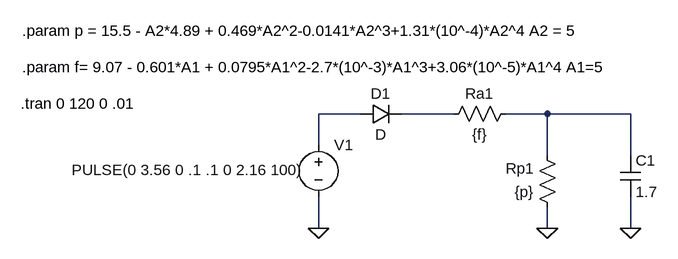
[diagram p0: schematic modelo_simulación.asc]
modelo_simulación.asc, the LTspice schematic file:
Version 4
SHEET 1 1532 680
WIRE 1056 32 992 32
WIRE 1200 32 1120 32
WIRE 1344 32 1280 32
WIRE 1472 32 1344 32
WIRE 992 80 992 32
WIRE 1344 96 1344 32
WIRE 1472 96 1472 32
WIRE 992 208 992 160
WIRE 1344 208 1344 176
WIRE 1472 208 1472 160
FLAG 1344 208 0
FLAG 1472 208 0
FLAG 992 208 0
SYMBOL res 1296 16 R90
WINDOW 0 0 56 VBottom 2
WINDOW 3 32 56 VTop 2
SYMATTR InstName Ra1
SYMATTR Value {f}
SYMBOL res 1360 192 R180
WINDOW 0 36 76 Left 2
WINDOW 3 36 40 Left 2
SYMATTR InstName Rp1
SYMATTR Value {p}
SYMBOL cap 1456 96 R0
SYMATTR InstName C1
SYMATTR Value 1.7
SYMBOL voltage 992 64 R0
WINDOW 3 -380 54 Left 2
WINDOW 123 0 0 Left 0
WINDOW 39 0 0 Left 0
SYMATTR InstName V1
SYMATTR Value PULSE(0 3.56 0 .1 .1 0 2.16 100)
SYMBOL diode 1056 48 R270
WINDOW 0 32 32 VTop 2
WINDOW 3 0 32 VBottom 2
SYMATTR InstName D1
TEXT 534 16 Left 2 !.tran 0 120 0 .01
TEXT 536 -40 Left 2 !.param f= 9.07 - 0.601*A1 + 0.0795*A1^2-2.7*(10^-3)*A1^3+3.06*(10^-5)*A1^4 A1=5
TEXT 536 -96 Left 2 !.param p = 15.5 - A2*4.89 + 0.469*A2^2-0.0141*A2^3+1.31*(10^-4)*A2^4 A2 = 5

The netlist it stands for:
* modelo_simulación.asc
Ra1 N003 N002 {f}
Rp1 0 N003 {p}
C1 N003 0 1.7
V1 N001 0 PULSE(0 3.56 0 .1 .1 0 2.16 100)
D1 N001 N002 D
.model D D
.lib standard.dio
.tran 0 120 0 .01
.param f= 9.07 - 0.601*A1 + 0.0795*A1^2-2.7*(10^-3)*A1^3+3.06*(10^-5)*A1^4 A1=5
.param p = 15.5 - A2*4.89 + 0.469*A2^2-0.0141*A2^3+1.31*(10^-4)*A2^4 A2 = 5
.backanno
.end